# Altium project PROTO RF.PrjPcb
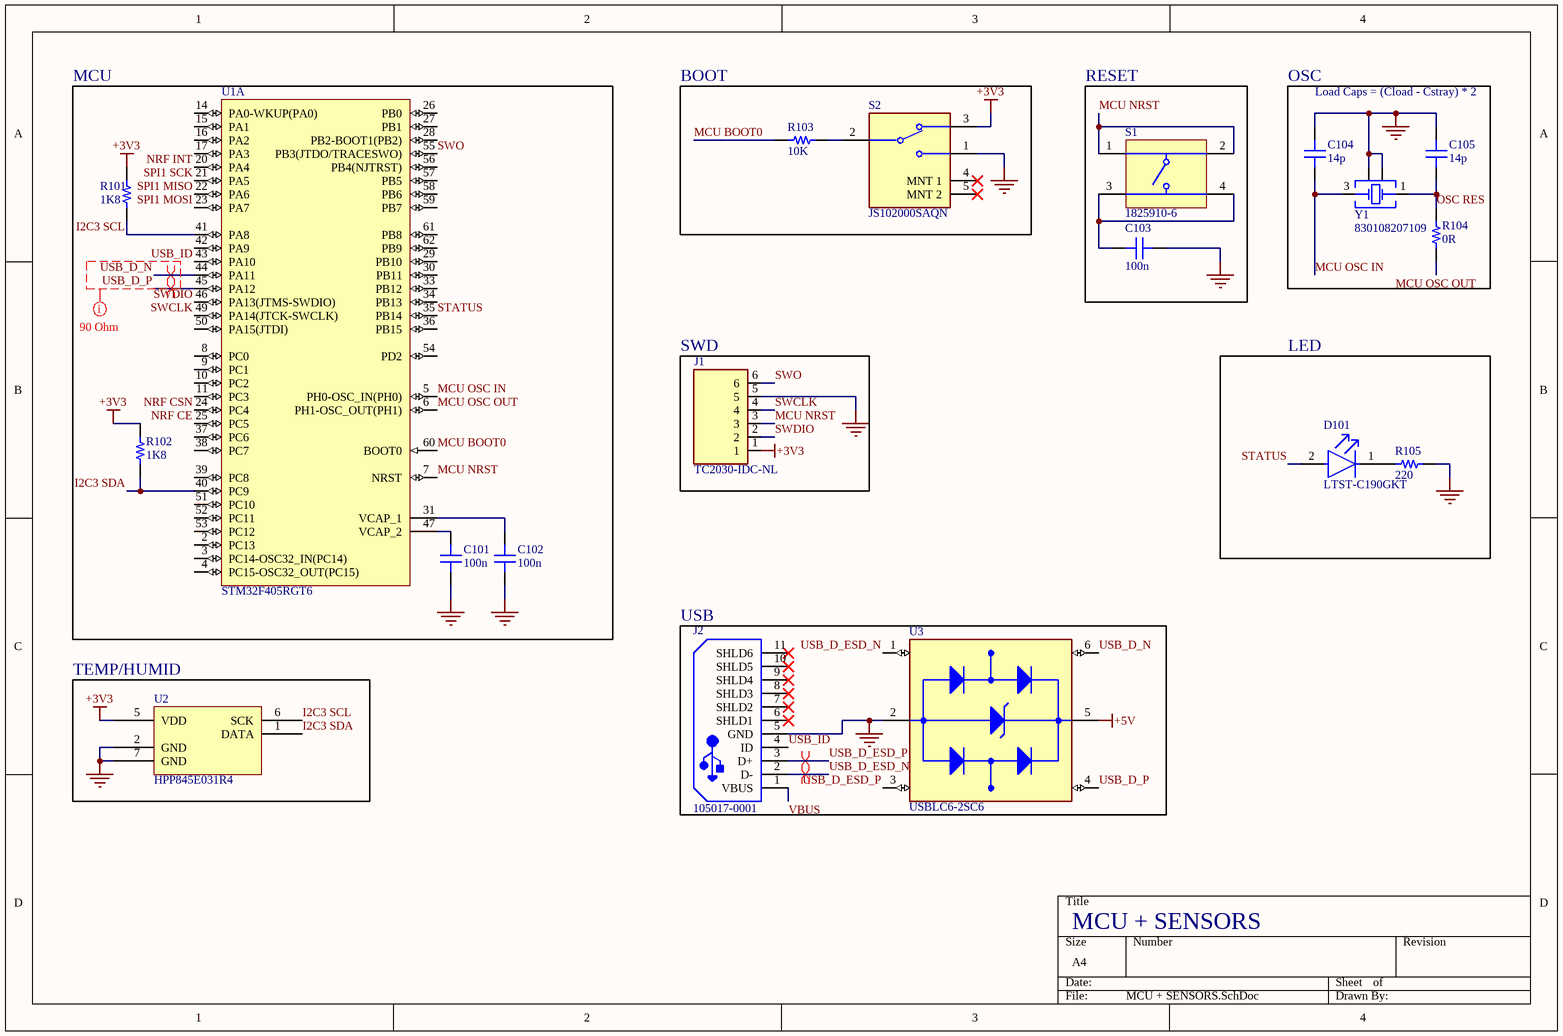
[diagram p0: MCU + SENSORS.SchDoc]
3 sheets, 52 parts. Net scope: global (net labels, ports and power ports of the same name join across sheets).
Board file: PCB.PcbDoc
Sheets:
  MCU + SENSORS.SchDoc
  POWER.SchDoc
  RF.SchDoc

## Sheet MCU + SENSORS.SchDoc
size A4; SheetNumber: 1; SheetTotal: 3

### Parts
C101  100n  [CAP 0402_1005]
C102  100n  [CAP 0402_1005]
C103  100n  [CAP 0402_1005]
C104  14p  [CAP 0402_1005]
C105  14p  [CAP 0402_1005]
D101  LTST-C190GKT  [FP-LTST-C190GKT-MFG]
J1  TC2030-IDC-NL  [TAG_TC2030-IDC-NL]
J2  105017-0001  [USB-MICRO-B_V]
R101  1K8  [RES 0402_1005]
R102  1K8  [RES 0402_1005]
R103  10K  [RES 0402_1005]
R104  0R  [RES 0402_1005]
R105  220  [RES 0402_1005]
S1  1825910-6  [TECO-1825910-6_V]
S2  JS102000SAQN  [FP-JS102000SAQN-MFG]
U1  STM32F405RGT6  [STM-LQFP64_M]  (part A of 2)
U2  HPP845E031R4  [TE HPP845E031R4]
U3  USBLC6-2SC6  [SOT95P280X145-6N]
Y1  830108207109  [WE-XTAL_CFPX-180]

### Blocks framed on the sheet
MCU: C101 C102 R101 R102 U1
BOOT: R103 S2
RESET: C103 S1
OSC: C104 C105 R104 Y1
SWD: J1
LED: D101 R105
USB: J2 U3
TEMP/HUMID: U2

### Nets
+3V3: J1.1 R101.2 R102.2 S2.3 U2.5(VDD)
+5V: U3.5(VBUS)
GND: C101.1 C102.1 C103.1 C104.2 C105.2 J1.5 J2.5(GND) R105.2 S2.1 U2.2(GND) U2.7(GND) U3.2(GND) Y1.2(GND&Lid) Y1.4(GND&Lid)
I2C3 SCL: R101.1 U1.41(PA8) U2.6(SCK)
I2C3 SDA: R102.1 U1.40(PC9) U2.1(DATA)
MCU BOOT0: R103.1 U1.60(BOOT0)
MCU NRST: J1.3 S1.1 S1.2 U1.7(NRST)
MCU OSC IN: C104.1 U1.5(PH0-OSC_IN(PH0)) Y1.3(Crystal)
MCU OSC OUT: R104.1 U1.6(PH1-OSC_OUT(PH1))
NRF CE: U1.25(PC5)
NRF CSN: U1.24(PC4)
NRF INT: U1.20(PA4)
OSC RES: C105.1 R104.2 Y1.1(Crystal)
SPI1 MISO: U1.22(PA6)
SPI1 MOSI: U1.23(PA7)
SPI1 SCK: U1.21(PA5)
STATUS: D101.2(A) U1.35(PB14)
SWCLK: J1.4 U1.49(PA14(JTCK-SWCLK))
SWDIO: J1.2 U1.46(PA13(JTMS-SWDIO))
SWO: J1.6 U1.55(PB3(JTDO/TRACESWO))
USB_D_ESD_N: J2.2(D-) U3.1(I/O1_IN)
USB_D_ESD_P: J2.3(D+) U3.3(I/O2_IN)
USB_D_N: U1.44(PA11) U3.6(I/O1_OUT)
USB_D_P: U1.45(PA12) U3.4(I/O2_OUT)
USB_ID: J2.4(ID) U1.43(PA10)
VBUS: J2.1(VBUS)
NetC101_2: C101.2 U1.47(VCAP_2)
NetC102_2: C102.2 U1.31(VCAP_1)
NetC103_2: C103.2 S1.3 S1.4
NetD101_1: D101.1(C) R105.1
NetR103_2: R103.2 S2.2(C)

Not connected (* = marked no-connect by the designer): J2 6(SHLD1)* 7(SHLD2)* 8(SHLD3)* 9(SHLD4)* 10(SHLD5)* 11(SHLD6)*; S2 4(MNT_1)* 5(MNT_2)*; U1 2(PC13) 3(PC14-OSC32_IN(PC14)) 4(PC15-OSC32_OUT(PC15)) 8(PC0) 9(PC1) 10(PC2) 11(PC3) 14(PA0-WKUP(PA0)) 15(PA1) 16(PA2) 17(PA3) 26(PB0) 27(PB1) 28(PB2-BOOT1(PB2)) 29(PB10) 30(PB11) 33(PB12) 34(PB13) 36(PB15) 37(PC6) 38(PC7) 39(PC8) 42(PA9) 50(PA15(JTDI)) 51(PC10) 52(PC11) 53(PC12) 54(PD2) 56(PB4(NJTRST)) 57(PB5) 58(PB6) 59(PB7) 61(PB8) 62(PB9)

### Layout directives
differential pair: USB_D_ESD_N, USB_D_ESD_P, USB_D_N, USB_D_P
net class 90 Ohm: USB_D_N, USB_D_P

### Notes on the sheet
- Load Caps = (Cload - Cstray) * 2
- MCU + SENSORS

### Library data of the parts
C101 C102 = CL05B104KP5VPNC: CAP CER 100NF 10V X7R 0402; manufacturer: Samsung Electro-Mechanics; Capacitance: 0.1 µF; Tolerance: ±10%; Part Number: CL05B104KP5VPNC; Value: 100n; Applications: Automotive; componentlink1description: Datasheet; componentlink1url: https://mm.digikey.com/Volume0/opasdata/d220001/medias/docus/5458/CL05B104KP5VPNC_Spec.pdf; componentlink2description: DigiKey Link; componentlink2url: https://www.digikey.com/en/products/detail/samsung-electro-mechanics/CL05B104KP5VPNC/20498482; Device Package: 0402 (1005 Metric); lastupdated: 29/01/2024 8:03:07 PM; Lifecycle Status: Active; Minimum Order: 1; Mounting Type: Surface Mount, MLCC; Operating Temperature: -55°C ~ 125°C; Package / Case: 0402 (1005 Metric); packaging: TapeAndReel; partid: 56690; price: 0.01; Ratings: AEC-Q200; series: CL; Size / Dimension: 0.039" L x 0.020" W (1.00mm x 0.50mm); Supplier 1: DigiKey; Supplier Part Number 1: 1276-CL05B104KP5VPNCCT-ND; Temperature Coefficient: X7R; Thickness (Max): 0.022" (0.55mm); Voltage - Rated: 10V
C103 = CL05B104KP5VPNC: CAP CER 100NF 10V X7R 0402; Part Number: CL05B104KP5VPNC
C104 C105 = GJM1555C1H140GB01D: CAP CER 14PF 50V C0G/NP0 0402; Part Number: GJM1555C1H140GB01D
D101 = CMP-22017-000005-2: LED GREEN CLEAR CHIP SMD; Dominant Wavelength: 569nm; Reverse Voltage: 5V; Lens Color: Colorless; Viewing Angle: 130°; Voltage: 2V; Forward Current: 30mA; Power Dissipation: 100mW; Luminous Intensity: 6mcd; Number of LEDs: 1; Forward Voltage: 2.1V; Wavelength: 565nm; Test Current: 10mA; Min Operating Temperature: -55°C; Lens Style: Clear; Mount: Surface Mount; Width: 0.8mm; Packaging: Tape and Reel; Lens Transparency: Clear; Case Code (Metric): 1608; Depth: 0.8mm; Case Code (Imperial): 0603; Case/Package: 0603; Number of Pins: 2; Max Operating Temperature: 85°C; Lead Free: Lead Free; Number of Elements: 1; Length: 1.6mm; Height: 0.8mm; Package Quantity: 1; Power Rating: 100mW; Radiation Hardening: No; Illumination Color: Green; Color: Green
J1 = TC2030-IDC-NL: CABLE ADAPTER 6 POS; Value: *; MP: TC2030-IDC-NL; Availability: Unavailable; Package: None; Price: None
J2 = CMP-2000-05827-1: Micro-USB B Receptacle, Right Angle, Bottom Mount, Surface Mount, with Solder Tabs, -30 to 85 degC, 5-Pin USB, RoHS, Tape and Reel; Manufacturer: Molex; Featured Product: Micro-USBConnectorsUSBConnectors; Other Names: WM1399DKR; Package Version: Rev. F, 12/2012; Number of Contacts: 5; Connector Type: USB-microB; Catalog Drawings: 1050170001; 3D Model: 105017-0001.stp; Mating Products: WM17145-ND-CABLEMICROUSBBTOSTDA1.0MWM17147-ND-CABLEMICROUSBBTOSTDA2.0MWM17146-ND-CABLEMICROUSBBTOSTDA1.5M; PCN Assembly/Origin: ResinSupplier21/Oct/2015; Voltage - Max: 30V; Online Catalog: Molex-MicroUSB; Manufacturer URL: http://www.molex.com/; Package Description: 5-Leads USB, Micro B, Body 7.5 x 5 mm, Pitch 0.65 mm; Datasheet URL: http://www.molex.com/elqNow/elqRedir.htm?ref=http://www.molex.com/webdocs/datasheets/pdf/en-us/1050170001_IO_CONNECTORS.pdf; Ingress Protection: -; Datasheet Version: 03/2016; Mounting Type: BoardCutout,SurfaceMount,RightAngle; Circuits: 5; Standard Package: 1; Package Reference: MICRO-B; Package URL: http://www.molex.com/pdm_docs/sd/1050170001_sd.pdf; Category: Connectors,Interconnects; Series: -; RoHS Information: 1050170001CertofCompliance; Features: Shielded,SolderRetention; Family: USB,DVI,HDMIConnectors; Specifications: -; Gender: Receptacle; Packaging: Digi-Reel®; Mounting Technology: SurfaceMount
R101-R103 R105 = RP73PF1E10KBTD: RES 10K OHM 0.1% 1/10W 0402; Part Number: RP73PF1E10KBTD
R104 = 5112: 0402 JUMPER ON TAPE AND REEL; Part Number: 5112
S1 = CMP-1684-00021-1: Tact Switch, SPST-NO, 0.05 A, -35 to 85 degC, 4-Pin THD, RoHS, Bulk; Manufacturer: TE Connectivity; Maximum Contact Resistance: 100mOhm; Mechanical Life: 100000Cycles; Bushing Type: Unthreaded; Switch Configuration: OFF(ON); Maximum DC Voltage Rating: 24V; Contact Rating @ Voltage: 0.05A@24VDC; Actuator Color: Black; Body Orientation: Straight; Function: MomentaryContact; Illumination: N/R; Actuator Style: RoundButton; Actuator Material: PolybutyleneTerephthalate; Dielectric Strength: 500VAC; Pole Throw Configuration: SPST; Actuator Length: 1.4mm; Product Weight: N/A; Contact Material: CopperAlloy; Housing Material: N/A; Terminal Type: PCPins; Minimum Insulation Resistance: 100MOhm; Package Description: 4-Pin Through Hole Device, Body 5.99 x 5.99 mm, Pitch 6.5 mm; Part No: 1825910-6; Package Reference: THD; Base Material: N/A; Manufacturer URL: http://www.te.com; Contact Plating: Silver; RoHS: Yes; Datasheet Version: Rev. C9; Electrical Life: 100000Cycles; Maximum AC Voltage Rating: N/A; Thread Size: N/R; Operating Temperature: -35to85C; Mounting: ThroughHole; Dimension: 5.99x5mm; Datasheet URL: http://www.te.com/commerce/DocumentDelivery/DDEController?Action=showdoc&DocId=Customer+Drawing%7F1825910%7FC9%7Fpdf%7FEnglish%7FENG_CD_1825910_C9.pdf%7F1825910-6; Family: 1825910; Seal Location: N/A; Seal Description: N/A; Packaging: N/A
S2 = CMP-10038-000025-1: SWITCH SLIDE SPDT 1MA 5V; Actuator Material: Nylon; Contact Resistance: 70mR; Electrical Life: 15000Cycles; Actuator Length: 1.5mm; Switch Function: On-On; Actuator Type: Standard; Actuator Color: Black; Current Rating: 1mA; Throw Configuration: SPDT; Termination: Gull Wing; Housing Material: Nylon; Max Operating Temperature: 85°C; Max Voltage Rating (DC): 5V; Voltage Rating (DC): 5V; Contact Plating: Silver; Radiation Hardening: No; Package Quantity: 1; REACH SVHC: No SVHC; RoHS Compliant: Yes; Orientation: Right Angle; Max Current Rating: 1mA; Case/Package: SMD/SMT; Contact Current Rating: 1mA; Contact Material: Copper Alloy; Mount: Surface Mount; Flammability Rating: UL94 V-2; Packaging: Tape and Reel; Switch Travel: 1.5mm; Length: 7.8mm; Series: JS; Min Operating Temperature: -20°C; Depth: 4.82mm
U1 = CMP-0243-00019-3: ARM Cortex-M4 32-bit MCU+FPU, 210 DMIPS, 1024 kB Flash, 192 kB Internal RAM, 51 I/Os, 64-pin LQFP, -40 to 85 degC, Tray; Manufacturer: STMicroelectronics; Supply Voltage(Vcc) min (V): 1.8; Supply Voltage(Vcc) max (V): 3.6; Internal RAM Size (kB): 192; I/Os (High Current): 51; D/A Converter: 2x12-bit; FLASH Size (Prog) (kB): 1024; Operating Frequency(F) (Processor speed) (MHz): 168; ComponentLink2Description: Datasheet; PackageVersion: Rev. 4, 06/2013; DatasheetVersion: Rev. 4; Core: ARM Cortex-M4; ComponentLink2URL: http://www.st.com/st-web-ui/static/active/en/resource/technical/document/datasheet/DM00037051.pdf; PackageReference: LQFP64; Packing: Tray; ComponentLink1Description: Manufacturer URL; ComponentLink3URL: http://www.st.com/st-web-ui/static/active/en/resource/technical/document/datasheet/DM00037051.pdf; ComponentLink3Description: Package Specification; Mounting Technology: Surface Mount; ComponentLink1URL: http://www.st.com/web/en/home.html; PackageDescription: 64-Pin Low Profile Quad Flat Package, 10 x 10 mm Body, 0.5 mm Pitch; PartNumber: STM32F405RGT6
U2 = HPP845E031R4: SENSOR HUMID/TEMP 3V I2C 2% SMD; Part Number: HPP845E031R4
U3 = USBLC6-2SC6: 17V Clamp 5A (8/20Âµs) Ipp Tvs Diode Surface Mount SOT-23-6; MF: STMicroelectronics; Value: *; SnapEDA_Link: https://www.snapeda.com/parts/USBLC6-2SC6/STMicroelectronics/view-part/?ref=snap; Check_prices: https://www.snapeda.com/parts/USBLC6-2SC6/STMicroelectronics/view-part/?ref=eda; Purchase-URL: https://pricing.snapeda.com/search/part/USBLC6-2SC6/?ref=eda; Price: None; Availability: In Stock; Package: SOT-23-6 STMicroelectronics; MP: USBLC6-2SC6
Y1 = CMP-03913-116855757-1: 830108207109 WE-XTAL Quartz Crystal; Frequency: 16MHz; Width: 2.5mm; Max Operating Temperature: 85°C; Height: 800µm; NexarPartId: 116855757; Min Operating Temperature: -40°C; Length: 3.2mm

## Sheet POWER.SchDoc
size A4; SheetNumber: 2; SheetTotal: 3
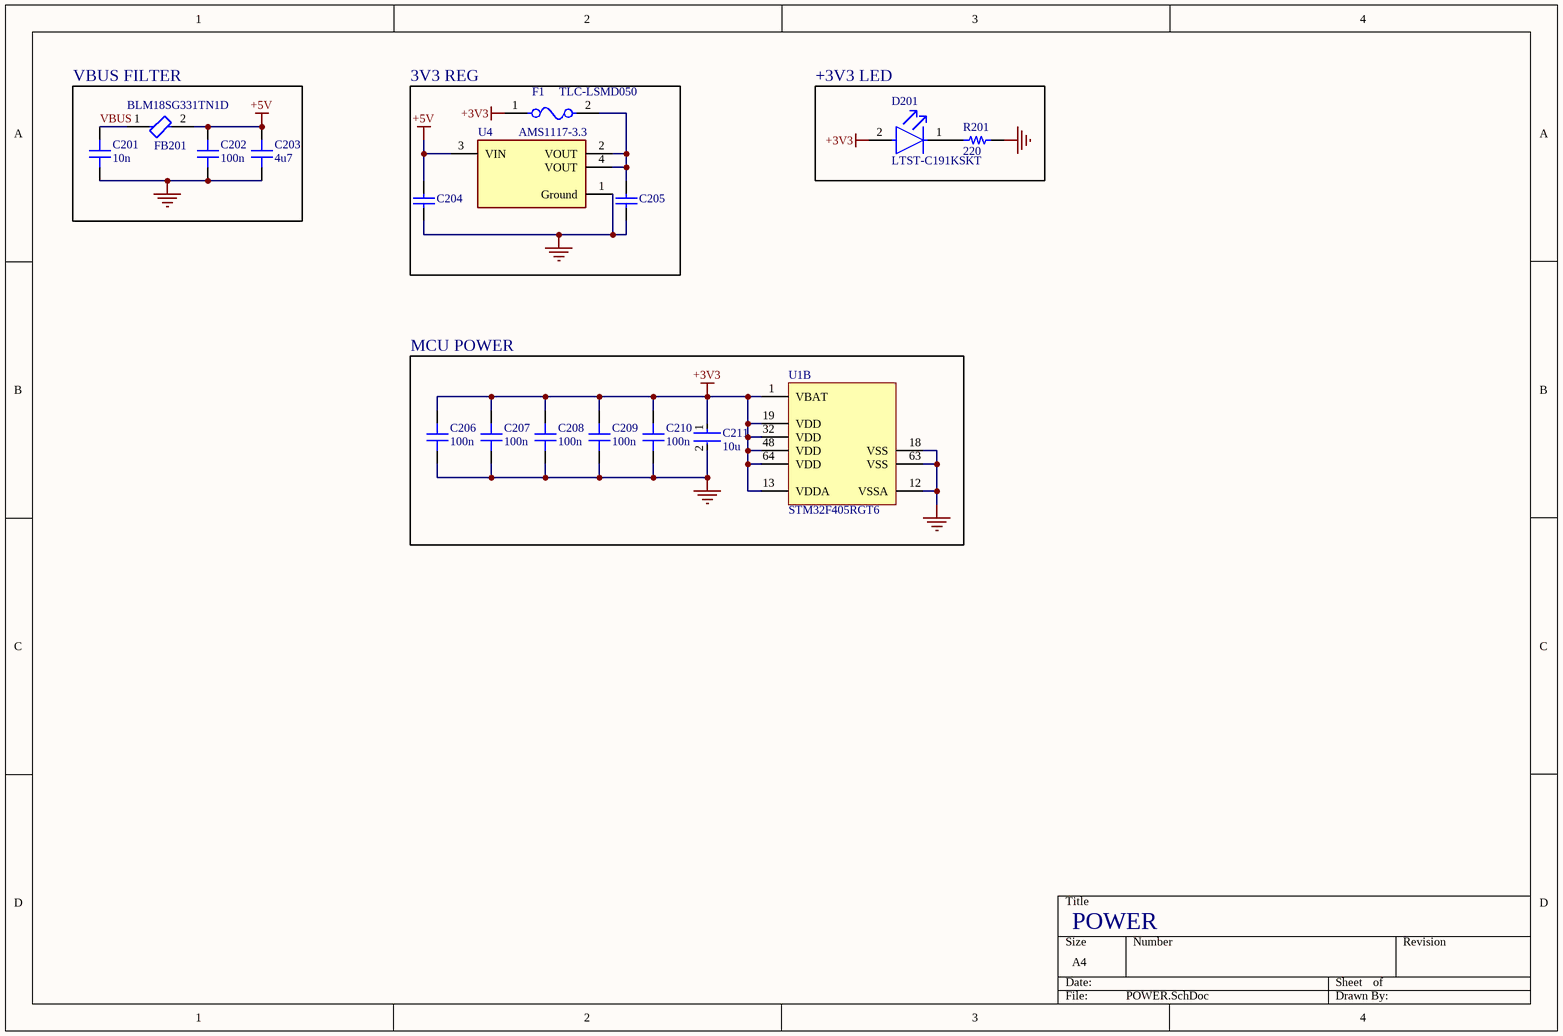
[diagram p1: POWER.SchDoc]

### Parts
C201  10n  [CAP 0603_1608]
C202  100n  [CAP 0603_1608]
C203  4u7  [CAP 0603_1608]
C204  T529P226M010AAE200  [CAPC2013X100X55ML10T10]  (value not drawn)
C205  T529P226M010AAE200  [CAPC2013X100X55ML10T10]  (value not drawn)
C206  100n  [CAP 0402_1005]
C207  100n  [CAP 0402_1005]
C208  100n  [CAP 0402_1005]
C209  100n  [CAP 0402_1005]
C210  100n  [CAP 0402_1005]
C211  10u  [FP-GRM21B-0_2-e0_2_0_7-IPC_B]
D201  LTST-C191KSKT  [FP-LTST-C191KSKT-MFG]
F1  TLC-LSMD050  [FP-2920L-MFG]
FB201  BLM18SG331TN1D  [FP-BLM18-0_15-t0_5-MFG]
R201  220  [RES 0402_1005]
U1  STM32F405RGT6  [STM-LQFP64_M]  (part B of 2)
U4  AMS1117-3.3  [FP-AMS1117-IPC_C]

### Blocks framed on the sheet
VBUS FILTER: C201-C203 FB201
3V3 REG: C204 C205 F1 U4
+3V3 LED: D201 R201
MCU POWER: C206-C211 U1

### Nets
+3V3: C206.2 C207.2 C208.2 C209.2 C210.2 C211.1 D201.2(A) F1.1 U1.1(VBAT) U1.13(VDDA) U1.19(VDD) U1.32(VDD) U1.48(VDD) U1.64(VDD)
+5V: C202.2 C203.2 C204.2 FB201.2 U4.3(VIN)
GND: C201.1 C202.1 C203.1 C204.1 C205.1 C206.1 C207.1 C208.1 C209.1 C210.1 C211.2 R201.2 U1.12(VSSA) U1.18(VSS) U1.63(VSS) U4.1(Ground)
VBUS: C201.2 FB201.1
NetC205_2: C205.2 F1.2 U4.2(VOUT) U4.4(VOUT)
NetD201_1: D201.1(C) R201.1

### Notes on the sheet
- POWER

### Library data of the parts
C201-C203 = CL10A226MPCNUBE: CAP CER 22UF 10V X5R 0603; Part Number: CL10A226MPCNUBE
C204 C205 = CMP-2007-03671-1: Manufacturer: Kemet; Part Number: T529P226M010AAE200
C206-C210 = CL05B104KP5VPNC: as C101 on sheet MCU + SENSORS; Part Number: CL05B104KP5VPNC; Value: 100n; Applications: Automotive; componentlink1description: Datasheet; componentlink1url: https://mm.digikey.com/Volume0/opasdata/d220001/medias/docus/5458/CL05B104KP5VPNC_Spec.pdf; componentlink2description: DigiKey Link; componentlink2url: https://www.digikey.com/en/products/detail/samsung-electro-mechanics/CL05B104KP5VPNC/20498482; Device Package: 0402 (1005 Metric); lastupdated: 29/01/2024 8:03:07 PM; Lifecycle Status: Active; Minimum Order: 1; Mounting Type: Surface Mount, MLCC; Operating Temperature: -55°C ~ 125°C; Package / Case: 0402 (1005 Metric); packaging: TapeAndReel; partid: 56690; price: 0.01; Ratings: AEC-Q200; series: CL; Size / Dimension: 0.039" L x 0.020" W (1.00mm x 0.50mm); Supplier 1: DigiKey; Supplier Part Number 1: 1276-CL05B104KP5VPNCCT-ND; Temperature Coefficient: X7R; Thickness (Max): 0.022" (0.55mm); Voltage - Rated: 10V
C211 = CMP-06035-047417-1: Chip Multilayer Ceramic Capacitors for General Purpose, 0805, 10uF, X7R, 15%, 10%, 25V
D201 = CMP-22017-000025-1: LED YELLOW CLEAR SMD; Dominant Wavelength: 597nm; Power Rating: 75mW; Number of LEDs: 1; Lens Style: Diffused; Forward Current: 30mA; Test Current: 20mA; Forward Voltage: 2.4V; Wavelength: 588nm; Viewing Angle: 130°; Lens Color: Colorless; Reverse Voltage: 5V; Luminous Intensity: 180mcd; Case Code (Imperial): 0603; Width: 0.8mm; Power Dissipation: 75mW; Length: 1.6mm; Illumination Color: Yellow; Number of Pins: 2; Case Code (Metric): 1608; Mount: Surface Mount; Number of Elements: 1; Height: 0.55mm; Lens Transparency: Clear; Depth: 0.8mm; Min Operating Temperature: -55°C; Case/Package: 0603; Radiation Hardening: No; Max Operating Temperature: 85°C; Package Quantity: 1; Packaging: Tape and Reel; Lead Free: Lead Free; Color: Yellow
F1 = CMP-2000-05550-2: PTC RESET FUSE 15V 3A 2920; Manufacturer: Littelfuse; Manufacturer Part Number: 2920L300/15DR; Current Rating: 40A; Trip Current: 5A; Trip Time: 20s; Resistance: 0.015-0.048Ω; Value: 0.015-0.048Ω; Device Class L3: unset; Temperature: -40°C to +85°C; ComponentLink2Description: Datasheet; Temperature Range High: +85°C; Digikey Description: PTC RESET FUSE 15V 3A 2920; Lead Free: Yes; Height: 1.25mm; Voltage Rating: 15V; Package: 2920L; Temperature Range Low: -40°C; Ambient Temperature Range High: +85°C; RoHS: TRUE; Ambient Temperature Range Low: -40°C; Device Class L2: PTC Resettable Fuses; Category: Fuse; Automotive: No; ComponentLink2URL: https://m.littelfuse.com/~/media/electronics/datasheets/resettable_ptcs/littelfuse_ptc_2920l_datasheet.pdf.pdf; Device Class L1: Circuit Protection; Hold Current: 3A; Octopart: https://octopart.com/2920l300%2F15dr-littelfuse-673797
FB201 = CMP-0686-00608-3: Chip Ferrite Bead, 0603, 330Ω @ 100MHz, 25%, 0.07Ω, 1.5A; Impedance: 330R; Number of Lines: 1; DC Resistance-Max: 70mR; RoHS Compliant: Yes; Series: BLM18S; Max Current Rating: 1.5A; Width: 0.8mm; Case Code (Metric): 1608; Min Operating Temperature: -55°C; Number of Pins: 2; Lead Free: Lead Free; Material: Ferrite; DC Resistance (DCR): 70mR; Frequency: 100MHz; Tolerance: 25%; REACH SVHC: No SVHC; Current Rating: 1.5A; Depth: 0.8mm; Length: 1.6mm; Packaging: Tape and Reel; Case/Package: 0603; Termination: SMD/SMT; Number of Circuits: 1; Max Operating Temperature: 125°C; Case Code (Imperial): 0603; Height: 0.8mm; Package Quantity: 1; Max DC Current: 1.5A; Core Material: Ferrite; Test Frequency: 100MHz
R201 = RP73PF1E10KBTD: RES 10K OHM 0.1% 1/10W 0402; Part Number: RP73PF1E10KBTD
U1 = CMP-0243-00019-3: as U1 on sheet MCU + SENSORS; ComponentLink2Description: Datasheet; PackageVersion: Rev. 4, 06/2013; DatasheetVersion: Rev. 4; Core: ARM Cortex-M4; ComponentLink2URL: http://www.st.com/st-web-ui/static/active/en/resource/technical/document/datasheet/DM00037051.pdf; PackageReference: LQFP64; Packing: Tray; ComponentLink1Description: Manufacturer URL; ComponentLink3URL: http://www.st.com/st-web-ui/static/active/en/resource/technical/document/datasheet/DM00037051.pdf; ComponentLink3Description: Package Specification; Mounting Technology: Surface Mount; ComponentLink1URL: http://www.st.com/web/en/home.html; PackageDescription: 64-Pin Low Profile Quad Flat Package, 10 x 10 mm Body, 0.5 mm Pitch; PartNumber: STM32F405RGT6
U4 = CMP-209535-000001-1: LDO Voltage Regulators 1A, 3.3V; Manufacturer: Advanced Monolithic Systems; Dropout Voltage: 1.1V; Output Type: Fixed; Nominal Supply Current: 5mA; Max Power Dissipation: 1.2W; Max Supply Voltage: 15V; Number Of Outputs: 1; Standoff Height: 0.64mm; Max Junction Temp: +125°C; Height: 1.8mm; Package: AMS1117; Device Class L2: Power Management ICs; ComponentLink2Description: Datasheet; ComponentLink2URL: http://www.advanced-monolithic.com/pdf/ds1117.pdf; Category: IC; RoHS: TRUE; Automotive: No; Device Class L1: Integrated Circuits (ICs); Output Current: 1A; Device Class L3: Voltage Regulators - Linear; Temperature: -40°C to +125°C; Output Voltage: 3.3V; Manufacturer Part Number: AMS1117-3.3; Temperature Range Low: -40°C; Octopart: https://octopart.com/ams1117-3.3-advanced+monolithic+systems-25899300; Lead Free: Yes; Ipc Land Pattern Name: SOT229P700X180-4; Temperature Range High: +125°C

## Sheet RF.SchDoc
size A4; SheetNumber: 3; SheetTotal: 3
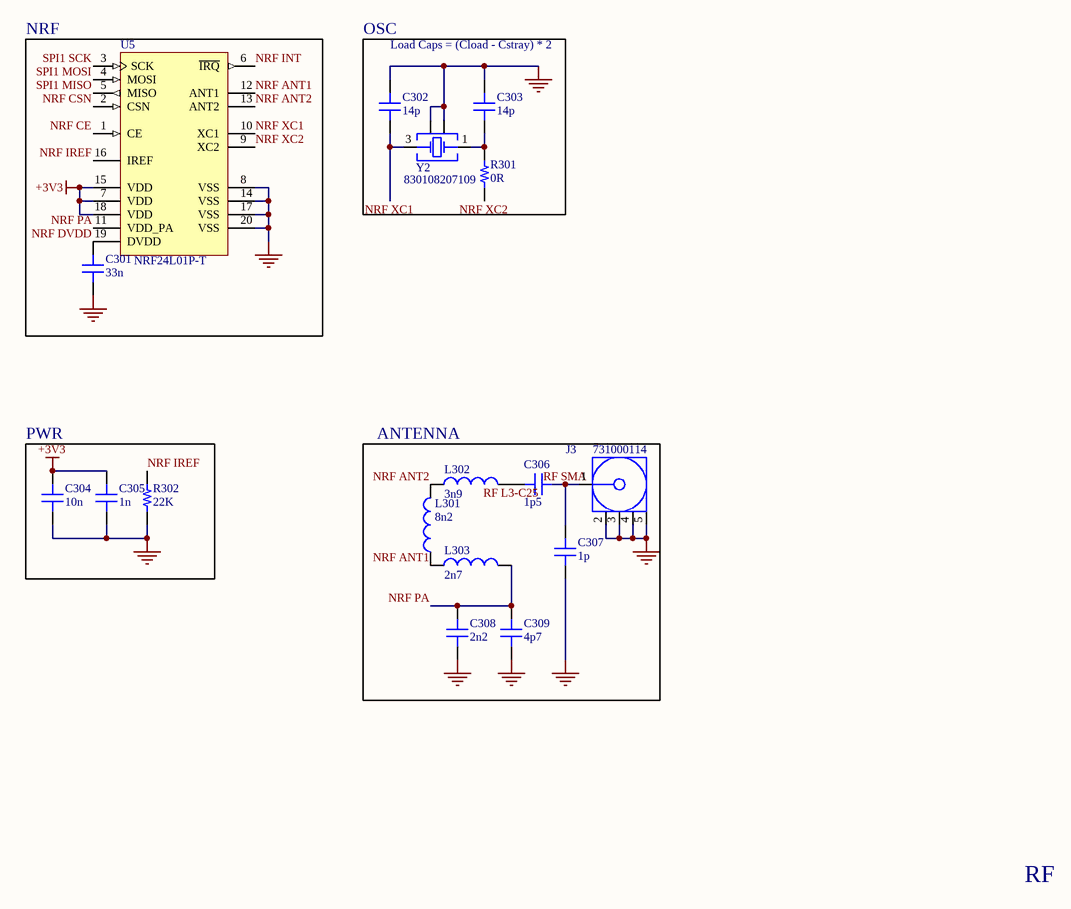
[diagram p2: RF.SchDoc]

### Parts
C301  33n  [CAP 0402_1005]
C302  14p  [CAP 0402_1005]
C303  14p  [CAP 0402_1005]
C304  10n  [CAP 0402_1005]
C305  1n  [CAP 0402_1005]
C306  1p5  [CAP 0402_1005]
C307  1p  [CAP 0402_1005]
C308  2n2  [CAP 0402_1005]
C309  4p7  [CAP 0402_1005]
J3  731000114  [MOLX-731000114_V]
L301  8n2  [WE-TCI_0402]
L302  3n9  [WE-TCI_0402]
L303  2n7  [WE-TCI_0402]
R301  0R  [RES 0402_1005]
R302  22K  [RES 0402_1005]
U5  NRF24L01P-T  [NRSC-QFN-20_L]
Y2  830108207109  [WE-XTAL_CFPX-180]

### Blocks framed on the sheet
NRF: C301 U5
OSC: C302 C303 R301 Y2
PWR: C304 C305 R302
ANTENNA: C306-C309 J3 L301-L303

### Nets
+3V3: C304.2 C305.2 U5.7(VDD) U5.15(VDD) U5.18(VDD)
GND: C301.1 C302.2 C303.2 C304.1 C305.1 C307.1 C308.1 C309.1 J3.2 J3.3 J3.4 J3.5 R302.2 U5.8(VSS) U5.14(VSS) U5.17(VSS) U5.20(VSS) Y2.2(GND&Lid) Y2.4(GND&Lid)
NRF ANT1: L301.1 L303.1 U5.12(ANT1)
NRF ANT2: L301.2 L302.1 U5.13(ANT2)
NRF CE: U5.1(CE)
NRF CSN: U5.2(CSN)
NRF DVDD: C301.2 U5.19(DVDD)
NRF INT: U5.6(~{IRQ})
NRF IREF: R302.1 U5.16(IREF)
NRF PA: C308.2 C309.2 L303.2 U5.11(VDD_PA)
NRF XC1: C302.1 U5.10(XC1) Y2.3(Crystal)
NRF XC2: R301.2 U5.9(XC2)
RF L3-C25: C306.2 L302.2
RF SMA: C306.1 C307.2 J3.1
SPI1 MISO: U5.5(MISO)
SPI1 MOSI: U5.4(MOSI)
SPI1 SCK: U5.3(SCK)
NetC303_1: C303.1 R301.1 Y2.1(Crystal)

### Notes on the sheet
- Load Caps = (Cload - Cstray) * 2
- RF

### Library data of the parts
C301 = C0402C330J4RACAUTO: CAP CER 33PF 16V X7R 0402; manufacturer: KEMET; Tolerance: ±5%; Part Number: C0402C330J4RACAUTO; Value: 33n; Applications: Automotive, Bypass, Decoupling; Capacitance: 33 pF; componentlink1description: Datasheet; componentlink1url: https://api.kemet.com/component-edge/download/datasheet/C0402C330J4RACAUTO.pdf; componentlink2description: DigiKey Link; componentlink2url: https://www.digikey.com/en/products/detail/kemet/C0402C330J4RACAUTO/6219618; Device Package: 0402 (1005 Metric); lastupdated: 23/01/2024 8:04:40 PM; Lifecycle Status: Active; Minimum Order: 1; Mounting Type: Surface Mount, MLCC; Operating Temperature: -55°C ~ 125°C; Package / Case: 0402 (1005 Metric); packaging: TapeAndReel; partid: 1721; Part Status: Active; price: 0.01; Ratings: AEC-Q200; series: SMD Auto X7R; Size / Dimension: 0.039" L x 0.020" W (1.00mm x 0.50mm); Supplier 1: DigiKey; Supplier Part Number 1: 399-13708-1-ND; Temperature Coefficient: X7R; Thickness (Max): 0.022" (0.55mm); Voltage - Rated: 16V
C302 C303 = GJM1555C1H140GB01D: CAP CER 14PF 50V C0G/NP0 0402; Part Number: GJM1555C1H140GB01D
C304-C309 = C0402C103K4REC7867: CAP CER 0402 10NF 16V X7R 10%; manufacturer: KEMET; Capacitance: 10000 pF; Part Number: C0402C103K4REC7867; Applications: ESD Protection; componentlink1description: Datasheet; componentlink1url: https://connect.kemet.com:7667/gateway/IntelliData-ComponentDocumentation/1.0/download/datasheet/C0402C103K4REC7867; componentlink2description: DigiKey Link; componentlink2url: https://www.digikey.com/en/products/detail/kemet/C0402C103K4REC7867/8643577; Device Package: 0402 (1005 Metric); lastupdated: 23/01/2024 8:03:47 PM; Lifecycle Status: Active; Minimum Order: 1; Mounting Type: Surface Mount, MLCC; Operating Temperature: -55°C ~ 125°C; Package / Case: 0402 (1005 Metric); packaging: TapeAndReel; partid: 52124; Part Status: Active; price: 0.01; series: ESD SMD Comm X7R; Size / Dimension: 0.039" L x 0.020" W (1.00mm x 0.50mm); Supplier 1: DigiKey; Supplier Part Number 1: 399-C0402C103K4REC7867CT-ND; Temperature Coefficient: X7R; Thickness (Max): 0.022" (0.55mm); Tolerance: ±10%; Voltage - Rated: 16V
  C304: Value: 10n
  C305: Value: 1n
  C306: Value: 1p5
  C307: Value: 1p
  C308: Value: 2n2
  C309: Value: 4p7
J3 = CMP-2000-05487-1: SMA Right-Angle PCB Jack Receptacle, Brass Body, Gold Plated, 50 Ohm, 5-Pin THD, RoHS, Tray; Manufacturer: Molex; Datasheet Version: 09/2016; Package Description: 5-Pin Through Hole Device, Body 14.8 x 6.35 mm, Pitch 2.54 mm; Datasheet URL: http://www.molex.com/webdocs/datasheets/pdf/en-us/0731000114_RF_COAX_CONNECTORS.pdf; Manufacturer URL: http://www.molex.com/; Package Reference: 731000114; Mounting Technology: ThroughHole; Package URL: http://www.molex.com/pdm_docs/sd/731000114_sd.pdf
L301-L303 = CMP-03913-14415878-1: 744901039 Fixed Ind 3.9NH 340MA 500MOHM Sm; Self Resonant Frequency: 6GHz; Q Factor: 13; Core Material: Alumina; Test Frequency: 500MHz; DC Resistance (DCR): 370mΩ; Shielding: Unshielded; Inductance: 3.9nH; Case Code (Imperial): 0402; Termination: SMD/SMT; NexarPartId: 14415878; RoHS: Compliant; Packaging: Digi-Reel®; Min Operating Temperature: -40°C; Composition: Thin Film; Case Code (Metric): 1005; Current Rating: 340mA; Weight: 652.039032µg; Max DC Current: 340mA; Length: 1mm; Width: 500µm; REACH SVHC: Unknown; Case/Package: 0402; Height - Seated (Max): 406.4µm; Number of Pins: 2; Height: 320µm; Mount: Surface Mount; Max Operating Temperature: 125°C
R301 = 5112: as R104 on sheet MCU + SENSORS
R302 = RC0402FR-0722K1L: RES 22.1K OHM 1% 1/16W 0402; Manufacturer: Yageo; Power (Watts): 0.063W, 1/16W; Resistance: 22.1 kOhms; Temperature Coefficient: ±100ppm/°C; Part Number: RC0402FR-0722K1L; Value: 22K; ComponentLink1Description: Datasheet; ComponentLink1URL: https://www.yageo.com/upload/media/product/productsearch/datasheet/rchip/PYu-RC_Group_51_RoHS_L_10.pdf; ComponentLink2Description: DigiKey Link; ComponentLink2URL: https://www.digikey.com/en/products/detail/yageo/RC0402FR-0722K1L/726563; Composition: Thick Film; Device Package: 0402 (1005 Metric); Features: Moisture Resistant; Height - Seated (Max): 0.016" (0.40mm); LastUpdated: 23/01/2024 8:29:15 PM; Lifecycle Status: Active; Minimum Order: 1; Number of Terminations: 2; Operating Temperature: -55°C ~ 155°C; Package / Case: 0402 (1005 Metric); Packaging: CutTape; PartId: 2641; Part Status: Active; Price: 0.01; Series: RC_L; Size / Dimension: 0.039" L x 0.020" W (1.00mm x 0.50mm); Supplier 1: DigiKey; Supplier Part Number 1: 311-22.1KLRCT-ND; Supplier Device Package: 0402; Tolerance: ±1%
U5 = CMP-2000-06859-1: Single Chip Transceiver, 2.4 GHz, 60 mW, 1.9 to 3.6 V, -40 to 85 degC, 20-Pin QFN, RoHS, Tray; Manufacturer: Nordic Semiconductor; Data Rate (Max): 2Mbps; Current - Transmitting: 7mA~11.3mA; Power - Output: 0dBm; Other Names: 1490-1019; Online Catalog: nRF24L01+; Current - Receiving: 12.6mA~13.5mA; For Use With: 1490-1002-ND-KITEVALUATIONNRF24L01P1568-1295-ND-SPARKFUNTRANSCEIVERBREAKOUT-1568-1296-ND-SPARKFUNTRANSCEIVERBREAKOUT-1471-1410-ND-DEVBOARDNRFSCLICKNRF24L01P-MODULE-PCB-ND-KITEVALNRF24L01+PCBANTENNANRF24L01P-MODULE-SMA-ND-KITEVALNRF24L01+SMACONNNRF24L01P-UPGRADE-ND-UPGRADE2PCB/1SMANRF24L01103990038-ND-DEVDUINOSENSORNODEV1.3103990053-ND-DEVDUINOSENSORNODEV2(ATMEGA103990074-ND-DEVDUINOSENSORNODE106990026-ND-ENERGYMONITORSHIELDV2113990088-ND-WIRELESSGATESHIELD113990095-ND-DEVDUINOSENSORNODEV3(ATMEGA106030001-ND-ENERGYMONITORSHIELD1597-1361-ND-DEVDUINOSENSORNODEV2.2(ATMEG105990030-ND-RGBWSTRIPWIRELESSSHIELDV1.0; Frequency: 2.4GHz; Design Resources: DevelopmentToolSelector; RF Family/Standard: GeneralISM>1GHZ; Serial Interfaces: SPI; Sensitivity: -94dBm; Voltage - Supply: 1.9V~3.6V; Modulation: GFSK; GPIO: -; Package Reference: QFN20; Memory Size: -; Category: RF/IFandRFID; Type: TxRxOnly; Standard Package: 490; Package / Case: 20-VFQFNExposedPad; Packaging: Tray; Series: -; Package Description: 20-Pin Quad Flat No-lead Package, Body 4 x 4 mm, Pitch 0.5 mm; Datasheet Version: Rev. 1.0, 09/2008; Protocol: -; Manufacturer URL: http://www.nordicsemi.com/eng/Products/; Operating Temperature: -40°C~85°C; Family: RFTransceiverICs; Datasheet URL: http://www.nordicsemi.com/eng/content/download/2726/34069/file/nRF24L01P_Product_Specification_1_0.pdf; Mounting Technology: SurfaceMount
Y2 = CMP-03913-116855757-1: as Y1 on sheet MCU + SENSORS; Width: 2.5mm; Max Operating Temperature: 85°C; Height: 800µm; NexarPartId: 116855757; Min Operating Temperature: -40°C; Length: 3.2mm

## Nets that join several sheets
+3V3: MCU + SENSORS (5 pins), POWER (14 pins), RF (5 pins)
+5V: MCU + SENSORS (U3.5), POWER (5 pins)
GND: MCU + SENSORS (14 pins), POWER (16 pins), RF (19 pins)
NRF CE: MCU + SENSORS (U1.25), RF (U5.1)
NRF CSN: MCU + SENSORS (U1.24), RF (U5.2)
NRF INT: MCU + SENSORS (U1.20), RF (U5.6)
SPI1 MISO: MCU + SENSORS (U1.22), RF (U5.5)
SPI1 MOSI: MCU + SENSORS (U1.23), RF (U5.4)
SPI1 SCK: MCU + SENSORS (U1.21), RF (U5.3)
VBUS: MCU + SENSORS (J2.1), POWER (C201.2 FB201.1)